# Altium schematic sheet Main.SchDoc: Main
size A4; SheetNumber: 1; SheetTotal: 8
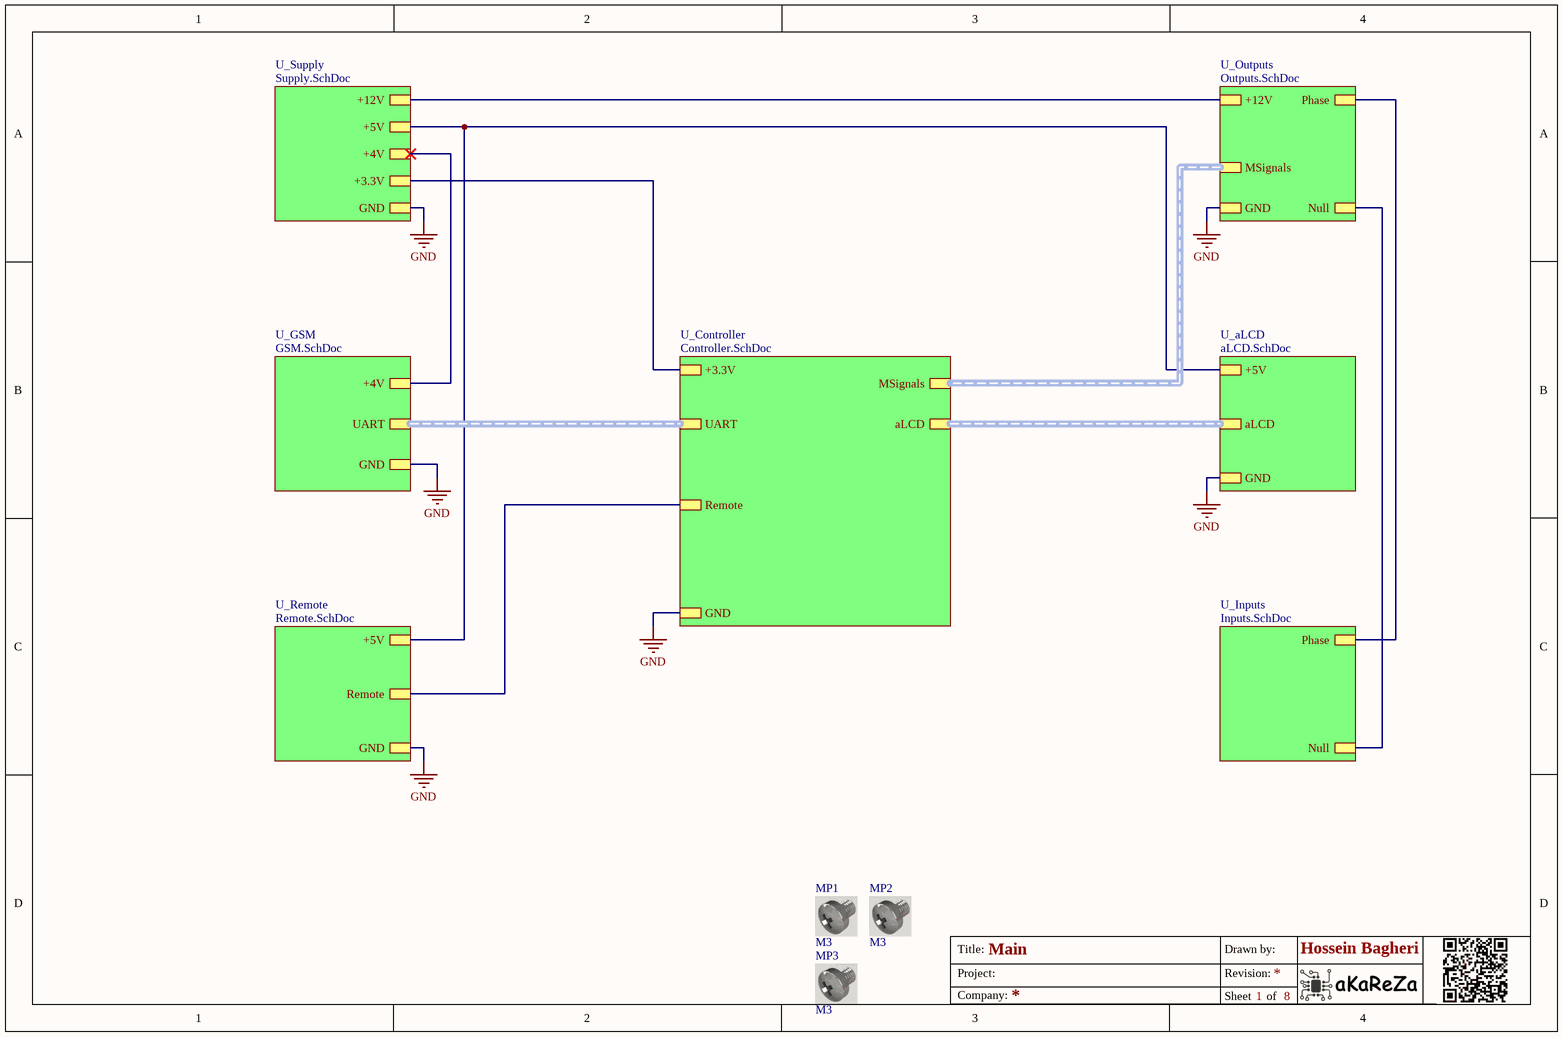
[diagram p0: Main.SchDoc]

## Parts
MP1  M3  [SCREW-M3]
MP2  M3  [SCREW-M3]
MP3  M3  [SCREW-M3]

## Sub-sheets
U_aLCD = aLCD.SchDoc: +5V, GND, aLCD (harness aLCD)
U_Controller = Controller.SchDoc: +3.3V, GND, aLCD (harness aLCD), MSignals (harness MotorSignals), UART (harness UART), Remote
U_GSM = GSM.SchDoc: +4V, GND, UART (harness UART)
U_Inputs = Inputs.SchDoc: Phase, Null
U_Outputs = Outputs.SchDoc: +12V, Phase, Null, GND, MSignals (harness MotorSignals)
U_Remote = Remote.SchDoc: +5V, GND, Remote
U_Supply = Supply.SchDoc: +12V, +5V, +3.3V, +4V, GND

## Nets
GND: sheet U_aLCD/GND, sheet U_Controller/GND, sheet U_GSM/GND, sheet U_Outputs/GND, sheet U_Remote/GND, sheet U_Supply/GND
(unnamed): sheet U_aLCD/+5V, sheet U_Remote/+5V, sheet U_Supply/+5V
(unnamed): sheet U_Controller/+3.3V, sheet U_Supply/+3.3V
(unnamed): sheet U_Controller/Remote, sheet U_Remote/Remote
(unnamed): sheet U_GSM/+4V, sheet U_Supply/+4V
(unnamed): sheet U_Inputs/Phase, sheet U_Outputs/Phase
(unnamed): sheet U_Inputs/Null, sheet U_Outputs/Null
(unnamed): sheet U_Outputs/+12V, sheet U_Supply/+12V

## Buses and harness runs
harness sheet U_aLCD/aLCD = sheet U_Controller/aLCD
harness sheet U_Controller/MSignals = sheet U_Outputs/MSignals
harness sheet U_Controller/UART = sheet U_GSM/UART

## Notes on the sheet
- Title:
- Project:
- Drawn by:
- Revision:
- Hossein Bagheri
- Company:
- Sheet
- of

## Library data of the parts
MP1-MP3 = Other_Mech_Screw: Board Screw With Spacer; Rating: Rating?; Inflow: 8243; Validation: Valid; Package: Package?; Type: Screw; Value: M3